# EAGLE schematic ChargeController (EAGLE 6.5.0)
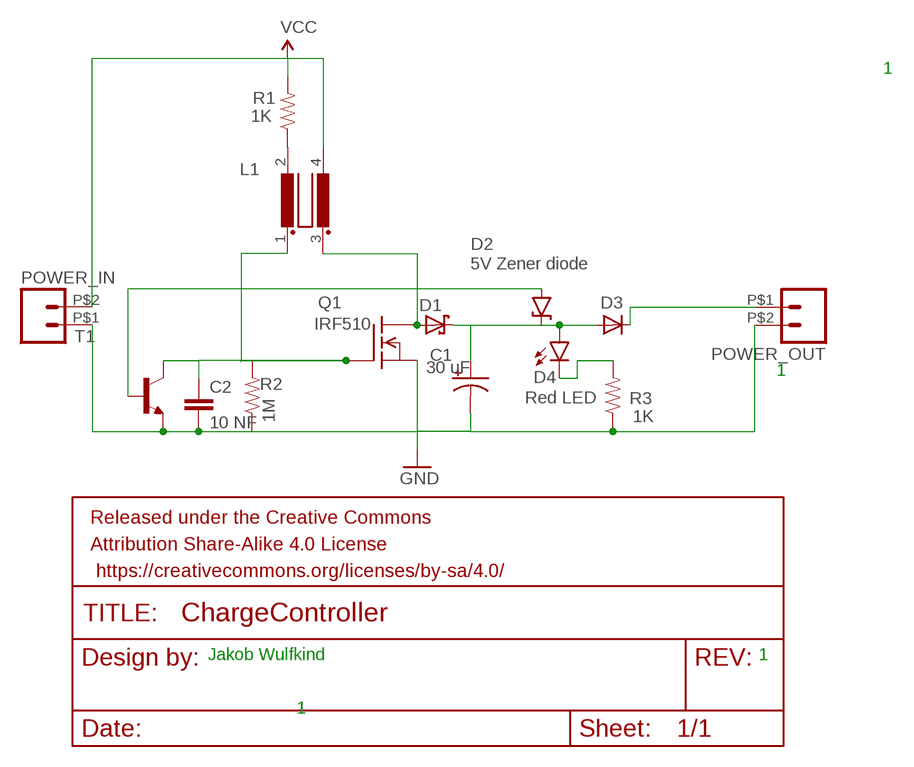
[diagram p0: schematic, sheet 1]

## Parts
C1  30 uF  CAP_POLPTH4  [CPOL-RADIAL-1000UF-25V]
C2  10 NF  0.1UF-50V-20%(PTH)KIT-EZ  [CAP-PTH-SMALL-KIT]
D1  SCHOTTKY-DIODEDO201T15  [DO201T15]
D2  5V Zener diode  DIODE-ZENERPTH  [DIODE-ZENER]
D3  1N5624  [DO201-15]
D4  Red LED  LED3MM  [LED3MM]
FRAME1  FRAME-LEDGER  [CREATIVE_COMMONS]
L1  R1003XB5  [B5]
POWER_IN  M02PTH2  [1X02_BIG]
POWER_OUT  M02PTH2  [1X02_BIG]
Q1  IRF510  [TO220]
R1  1K  RESISTORPTH-1/4W  [AXIAL-0.4]
R2  1M  RESISTORPTH-1/4W  [AXIAL-0.4]
R3  1K  RESISTORPTH-1/4W  [AXIAL-0.4]
T1  -NPN-TO92  [TO92]

## Nets
GND: C1.- C2.2 POWER_IN.P$1 POWER_OUT.P$2 Q1.3(S) R2.P$1 R3.P$1 T1.1(E)
N$1: D1.A L1.3 Q1.2(D)
N$2: C2.1 L1.1 Q1.1(G) R2.P$2 T1.3(C)
N$3: L1.2 R1.P$1
N$4: C1.+ D1.C D2.P$1(C) D3.A D4.A
N$5: D2.P$2(A) T1.2(B)
N$6: D3.C POWER_OUT.P$1
N$7: D4.K(C) R3.P$2
VCC: L1.4 POWER_IN.P$2 R1.P$2

## Notes on the sheet
- 1
- 1
- Jakob Wulfkind | 1
- 1

## Library data of the parts
C1 = SparkFun-Capacitors:CAP_POL: Capacitor Polarized These are standard SMD and PTH capacitors. Normally 10uF, 47uF, and 100uF in electrolytic and tantalum varieties. Always verify the external diameter of the through hole cap, it varies with capacity, voltage, and manufacturer. The EIA devices should be standard.
C2 = SparkFun-Capacitors:0.1UF-50V-20%(PTH): CAP-08370; PROD_ID: CAP-08370
D1 = diode:SCHOTTKY-DIODE: Schottky Diode
D2 = SparkFun-DiscreteSemi:DIODE-ZENER: Zener Diode Production Part - 8199 3.4V Zener Voltage
D3 = diode:1N5624: DIODE controlled avalanche rectifier
D4 = SparkFun-LED:LED: LEDs Standard schematic elements and footprints for 5mm, 3mm, 1206, and 0603 sized LEDs. 5mm - Spark Fun Electronics SKU : COM-00529 (and others)
FRAME1 = SparkFun-Aesthetics:FRAME-LEDGER: Schematic Frame Standard 11x14 US Ledger frame
L1 = inductor-nkl:R1003X: Gleichtakt-Entstördrossel (bis typ. 10MHz) common mode choke (up to typ. 10MHz); OC_FARNELL: unknown; OC_NEWARK: unknown
POWER_IN POWER_OUT = SparkFun-Connectors:M02: Standard 2-pin 0.1" header. Use with - straight break away headers ( PRT-00116) - right angle break away headers (PRT-00553) - swiss pins (PRT-00743) - machine pins (PRT-00117) - female headers (PRT-00115) Molex polarized connector foot print use with: PRT-08233 with associated crimp pins and housings. 2.54_SCREWTERM for use with PRT-10571. 3.5mm Screw Terminal footprints for PRT-08084 5mm Screw Terminal footprints for use with PRT-08432
Q1 = transistor-fet:IRF510: N-Channel Enhancement MOSFET (HEXFET); 100V; 5,6A; 0,54Ohm
R1-R3 = SparkFun-Resistors:RESISTOR: Resistor Basic schematic elements and footprints for 0603, 1206, and PTH resistors.
T1 = transistor:*-NPN-: NPN Transistror BF959 corrected 2008.03.06